# EAGLE design IMU_final (EAGLE 9.6.2)
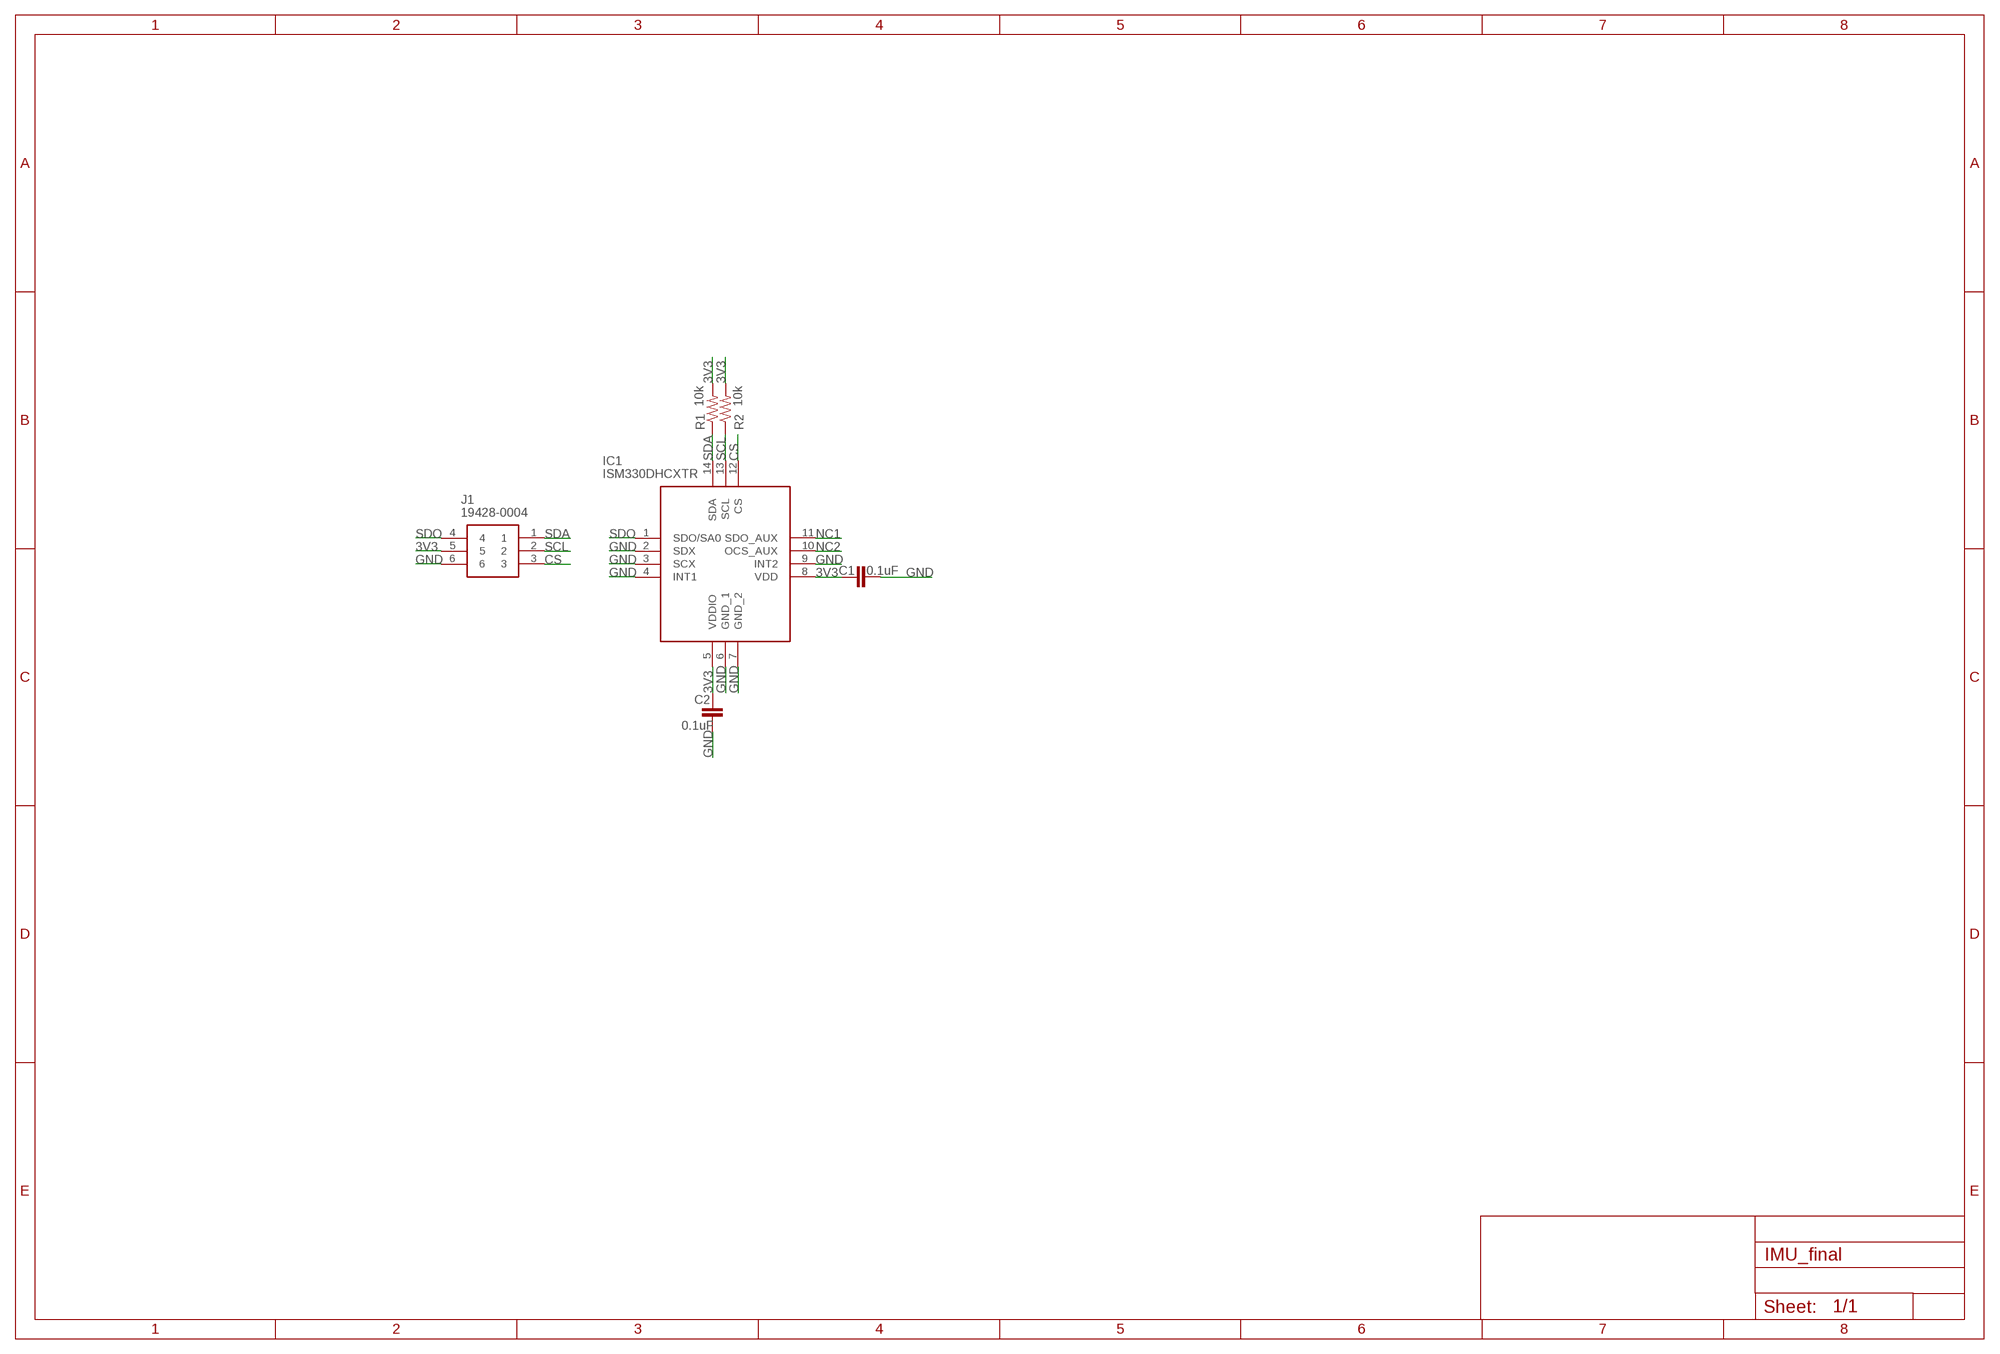
[diagram p0: schematic, sheet 1]

## Parts
C1  0.1uF  0.1UF-0603-25V-(+80/-20%)  [0603]
C2  0.1uF  0.1UF-0603-25V-(+80/-20%)  [0603]
IC1  ISM330DHCXTR  [LGA-14(2.5X3X0.86)]
J1  19428-0004  [194280004]
R1  10k  10KOHM-0603-1/10W-1%  [0603]
R2  10k  10KOHM-0603-1/10W-1%  [0603]

## Nets
3V3: C1.1 C2.1 IC1.5(VDDIO) IC1.8(VDD) J1.5 R1.2 R2.2
CS: IC1.12(CS) J1.3
GND: C1.2 C2.2 IC1.2(SDX) IC1.3(SCX) IC1.4(INT1) IC1.6(GND_1) IC1.7(GND_2) IC1.9(INT2) J1.6
NC1: IC1.11(SDO_AUX)
NC2: IC1.10(OCS_AUX)
SCL: IC1.13(SCL) J1.2 R2.1
SDA: IC1.14(SDA) J1.1 R1.1
SDO: IC1.1(SDO/SA0) J1.4

## Library data of the parts
C1 C2 = SparkFun-Capacitors:0.1UF: 0.1µF ceramic capacitors A capacitor is a passive two-terminal electrical component used to store electrical energy temporarily in an electric field.; PROD_ID: CAP-00810
IC1 = ISM330DHCXTR:ISM330DHCXTR: IMUs - Inertial Measurement Units VFLGA2.5X3X.86 14L P.5 L.475X.25 Source: Datasheet <https://www.st.com/resource/en/datasheet/ism330dhcx.pdf>; ARROW_PART_NUMBER: ISM330DHCXTR; ARROW_PRICE-STOCK: https://www.arrow.com/en/products/ism330dhcxtr/stmicroelectronics; DESCRIPTION: IMUs - Inertial Measurement Units VFLGA2.5X3X.86 14L P.5 L.475X.25; HEIGHT: mm; MANUFACTURER_NAME: STMicroelectronics; MANUFACTURER_PART_NUMBER: ISM330DHCXTR; MOUSER_PART_NUMBER: 511-ISM330DHCXTR; MOUSER_PRICE-STOCK: https://www.mouser.co.uk/ProductDetail/STMicroelectronics/ISM330DHCXTR?qs=%252B6g0mu59x7Jv2Xps2dM6Xw%3D%3D
J1 = SamacSys_Parts:19428-0004: Automotive Connectors Source: Datasheet <https://componentsearchengine.com/Datasheets/1/19428-0004.pdf>; ARROW_PART_NUMBER: 19428-0004; DESCRIPTION: Automotive Connectors; HEIGHT: 40.04mm; MANUFACTURER_NAME: Molex; MANUFACTURER_PART_NUMBER: 19428-0004; MOUSER_PART_NUMBER: 538-19428-0004; MOUSER_PRICE-STOCK: https://www.mouser.co.uk/ProductDetail/Molex/19428-0004?qs=l0xbah4rxIfd5Eogy17VMg%3D%3D
R1 R2 = SparkFun-Resistors:10KOHM: 10kΩ resistor A resistor is a passive two-terminal electrical component that implements electrical resistance as a circuit element. Resistors act to reduce current flow, and, at the same time, act to lower voltage levels within circuits. - Wikipedia; PROD_ID: RES-00824

## Board
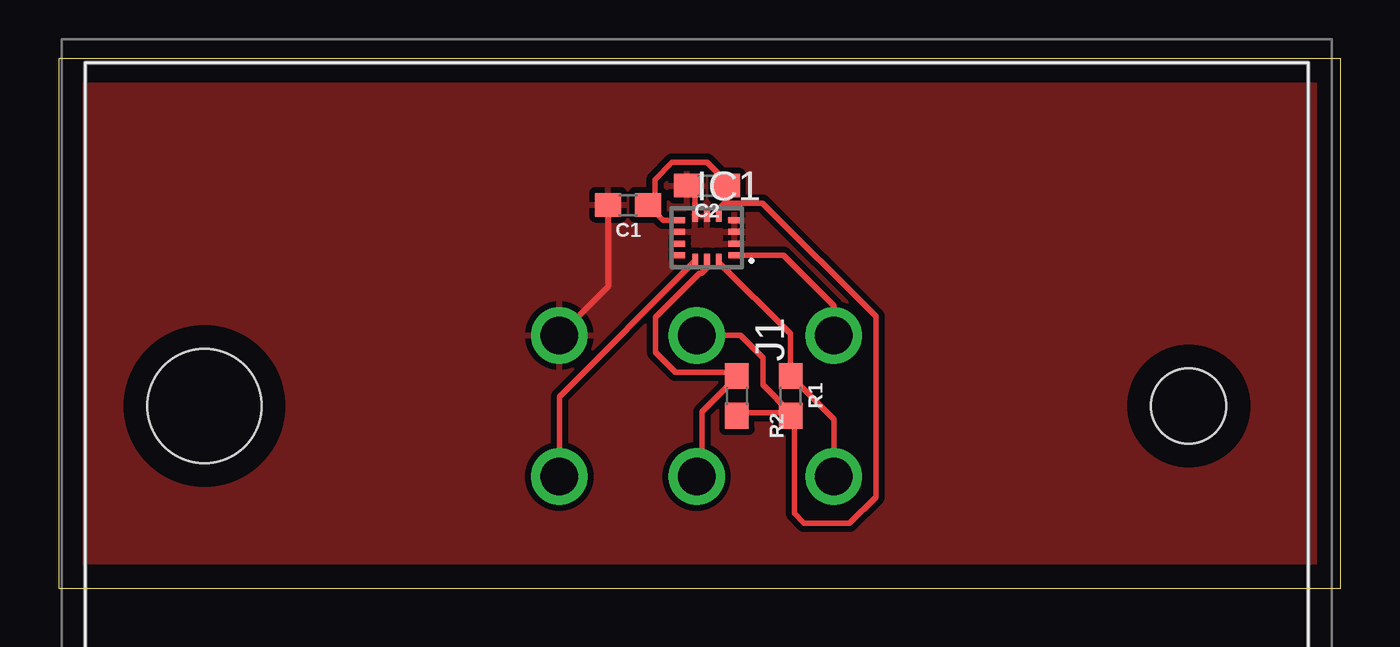
[diagram p1: board, top side]

Size 54.59 x 22.53 mm. Coordinates in mm from the lower left corner, seen from the top.
Outline: 54.59,22.53 0,22.53 0,0 54.59,0 54.59,22.53
Copper layers (1*16): Top 0.035mm / dielectric 1.5mm / Bottom 0.035mm
Design rules "default *": minimum track width 9.5mil, minimum drill 0.35mm, track to track 10mil, track to pad 9.5mil, pad to pad 9.5mil, via to via 6mil, smd to smd 6mil, copper to edge 40mil, drill to drill 6mil, minimum pad ring 10mil, minimum via ring 8mil, stop-mask expansion 4mil, vias tented up to drill 0mil, thermal gap 10mil

### Footprints (pad centres in the part's own frame; a part is rotated, then mirrored left to right if it is on the bottom)
0603 = smd 1.1 x 1: 1 -0.85,0; 2 0.85,0
LGA-14(2.5X3X0.86) = smd 0.475 x 0.25: 1 -1.163,0.75; 2 -1.163,0.25; 3 -1.163,-0.25; 4 -1.163,-0.75; 8 1.163,-0.75; 9 1.163,-0.25; 10 1.163,0.25; 11 1.163,0.75 | smd 0.25 x 0.475: 5 -0.5,-0.912; 6 0,-0.912; 7 0.5,-0.912; 12 0.5,0.912; 13 0,0.912; 14 -0.5,0.912
194280004 = drill 1.6 pad 2.4: 1 0,0; 2 5.84,0; 3 11.68,0; 4 0,-6; 5 5.84,-6; 6 11.68,-6 | hole 3.2: -15.115,-3 | hole 4.86: 26.795,-3

### Placement (x,y rotation side)
C1  24.24,16.31 180 top
C2  27.6,17.13 180 top
IC1  27.6,14.91 180 top
J1  33,4.75 180 top
R1  31.16,8.18 270 top
R2  28.87,8.18 270 top

### Tracks (layer width: path | path; a pad name or v marks a point on that pad's centre or on a via)
3V3
  Top 0.241: 28.45,16.38 C2.1 28.35,17.37 27.61,18.12 26.12,18.12 25.38,17.37 25.38,16.69 C1.1 25.73,15.66 IC1.8 | R2.2 29.09,7.47 31.08,7.47 R1.2 | 28.45,16.38 29.97,16.38 34.79,11.56 34.79,3.87 33.68,2.76 31.74,2.76 31.32,3.18 31.32,7.22 R1.2 | 28.45,16.38 28.35,16.38 28.1,16.13 IC1.5 | R1.2 31.16,7.47 29.98,8.65 29.98,9.81 29.04,10.75 J1.5
CS
  Top 0.241: IC1.12 27.1,13.93 21.32,8.15 J1.3
GND
  Top 0.241: C2.2 27.1,16.78 IC1.7 | 23.39,12.82 J1.6
  Top 0.254: C1.2 23.39,12.82
  pour Top: -0.02,22.53 -0.02,-0.33 54.59,-0.33 54.59,22.53
SCL
  Top 0.241: J1.2 27.39,4.98 27.39,7.5 28.85,8.95 R2.1 28.71,9.19 26.26,9.19 25.41,10.04 25.41,11.52 27.28,13.4 27.38,13.4 27.6,13.62 IC1.13
SDA
  Top 0.241: IC1.14 28.1,13.87 31.16,10.81 R1.1 33,7.19 J1.1
SDO
  Top 0.241: IC1.1 30.86,14.16 33,12.02 J1.4